# EAGLE design DBGadapter (EAGLE 7.1.0)
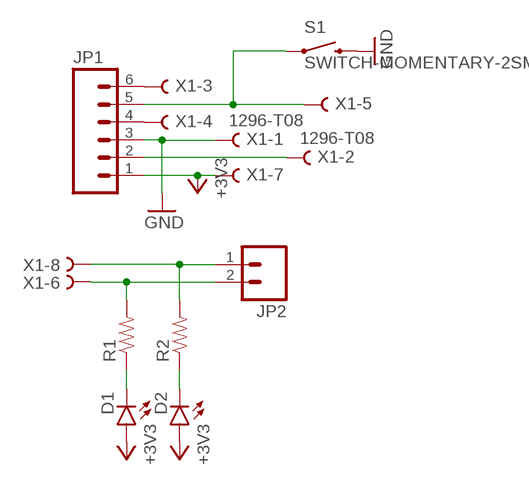
[diagram p0: schematic, sheet 1]

## Parts
D1  LED0603  [LED-0603]
D2  LED0603  [LED-0603]
JP1  M06LOCK_LONGPADS  [1X06_LOCK_LONGPADS]
JP2  M02LOCK_LONGPADS  [1X02_LOCK_LONGPADS]
R1  RESISTOR0805-RES  [0805]
R2  RESISTOR0805-RES  [0805]
S1  SWITCH-MOMENTARY-2SMD  [TACTILE-SWITCH-SMD]
X1  1296-T08  [1296-08]

## Nets
+3V3: D1.A D2.A JP1.1 X1.7
GND: JP1.3 S1.3 X1.1
N$1: JP1.2 X1.2
N$2: JP1.4 X1.4
N$3: JP1.5 S1.1 X1.5
N$5: JP1.6 X1.3
N$6: JP2.1 R2.2 X1.8
N$7: JP2.2 R1.2 X1.6
N$8: D2.C R2.1
N$9: D1.C R1.1

## Library data of the parts
D1 D2 = SparkFun-LED:LED: LEDs Standard schematic elements and footprints for 5mm, 3mm, 1206, and 0603 sized LEDs. 5mm - Spark Fun Electronics SKU : COM-00529 (and others)
JP1 = SparkFun-Connectors:M06: Header 6 Standard 6-pin 0.1" header. Use with straight break away headers (SKU : PRT-00116), right angle break away headers (PRT-00553), swiss pins (PRT-00743), machine pins (PRT-00117), and female headers (PRT-00115). Molex polarized connector foot print use with SKU : PRT-08094 with associated crimp pins and housings. NOTES ON THE VARIANTS LOCK and LOCK_LONGPADS... This footprint was designed to help hold the alignment of a through-hole component (i.e. 6-pin header) while soldering it into place. You may notice that each hole has been shifted either up or down by 0.005 of an inch from it's more standard position (which is a perfectly straight line). This slight alteration caused the pins (the squares in the middle) to touch the edges of the holes. Because they are alternating, it causes a "brace" to hold the component in place. 0.005 has proven to be the perfect amount of "off-center" position when using our standard breakaway headers. Although looks a little odd when you look at the bare footprint, once you have a header in there, the alteration is very hard to notice. Also,if you push a header all the way into place, it is covered up entirely on the bottom side. This idea of altering the position of holes to aid alignment will be further integrated into the Sparkfun Library for other footprints. It can help hold any component with 3 or more connection pins.
JP2 = SparkFun-Connectors:M02: Standard 2-pin 0.1" header. Use with - straight break away headers ( PRT-00116) - right angle break away headers (PRT-00553) - swiss pins (PRT-00743) - machine pins (PRT-00117) - female headers (PRT-00115) Molex polarized connector foot print use with: PRT-08233 with associated crimp pins and housings. 2.54_SCREWTERM for use with PRT-10571. 3.5mm Screw Terminal footprints for PRT-08084 5mm Screw Terminal footprints for use with PRT-08432
R1 R2 = SparkFun-Resistors:RESISTOR: Resistor Basic schematic elements and footprints for 0603, 1206, and PTH resistors.
S1 = SparkFun-Electromechanical:SWITCH-MOMENTARY-2: Various NO switches- pushbuttons, reed, etc; PROD_ID: SWCH-08247
X1 = con-leotronics:1296-T08: 1.27mm SINGLE ROW FEMALE SOCKET Source: http://www.leotronics.co.uk/Conexcon/Data%20Sheets/sec.%20A/1296ing.pdf; OC_FARNELL: unknown; OC_NEWARK: unknown

## Board
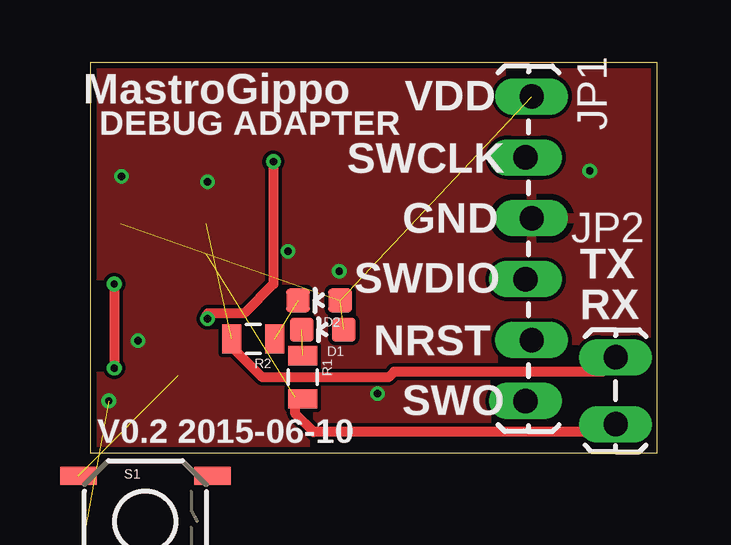
[diagram p1: board, top side]
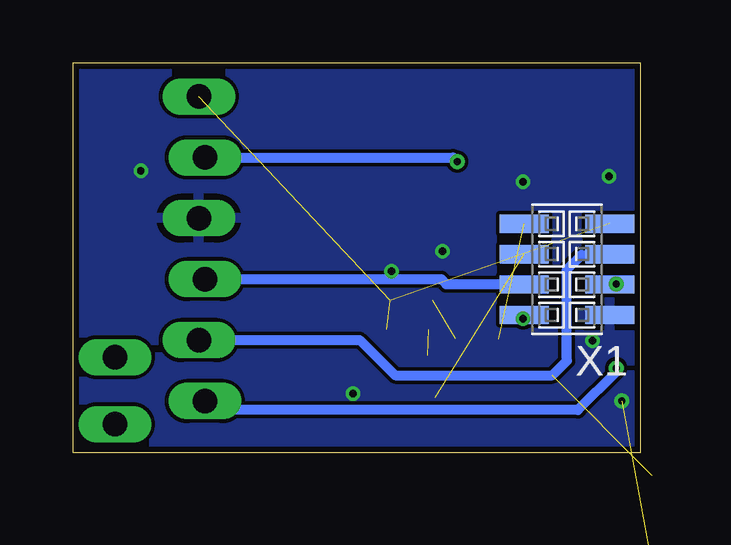
[diagram p2: board, bottom side, seen from below]

Size 23.64 x 16.26 mm. Coordinates in mm from the lower left corner, seen from the top.
Outline: 23.64,0 23.64,16.26 0,16.26 0,0 23.64,0
Copper layers (1*16): Top 0.035mm / dielectric 1.5mm / Bottom 0.035mm
Design rules "ITEADstudio_DRC": minimum track width 6mil, minimum drill 12mil, track to track 6mil, track to pad 6mil, pad to pad 6mil, via to via 6mil, smd to smd 0mil, copper to edge 10mil, drill to drill 10mil, minimum pad ring 10mil, minimum via ring 6mil, stop-mask expansion 2mil, vias tented up to drill 100mil, thermal gap 10mil

### Footprints (pad centres in the part's own frame; a part is rotated, then mirrored left to right if it is on the bottom)
LED-0603 = smd 1 x 1: A 0,-0.877; C 0,0.877
1X06_LOCK_LONGPADS = drill 1.016 long: 1 0,0; 2 2.54,-0.254; 3 5.08,0; 4 7.62,-0.254; 5 10.16,0; 6 12.7,-0.254
1X02_LOCK_LONGPADS = drill 1.016 long: 1 -0.127,0; 2 2.667,0
0805 = smd 0.8 x 1.2: 1 -0.9,0; 2 0.9,0
TACTILE-SWITCH-SMD = smd 1.524 x 0.762: 1 -2.794,1.905; 2 2.794,1.905; 3 -2.794,-1.905; 4 2.794,-1.905
1296-08 = smd 0.76 x 2.05: 1 -1.905,-1.78; 2 -1.905,1.78; 3 -0.635,-1.78; 4 -0.635,1.78; 5 0.635,-1.78; 6 0.635,1.78; 7 1.905,-1.78; 8 1.905,1.78

### Placement (x,y rotation side)
D1  9.69,5.13 90 top
D2  9.54,6.35 90 top
JP1  18.4,14.86 270 top
JP2  21.9,3.86 270 top
R1  8.86,3.15 270 top
R2  6.8,4.75 180 top
S1  2.3,-2.87 0 top
X1  3.06,7.65 90 bottom

### Tracks (layer width: path | path; a pad name or v marks a point on that pad's centre or on a via)
+3V3  (3 unrouted)
GND  (via drill 0.3)  (1 unrouted)
  other vias: 2,4.67 0.78,2.16 10.38,7.57 8.25,8.41 4.89,11.3 1.31,11.53 20.82,11.76 11.98,2.46
  pour Bottom: 0,0 23.64,0 23.64,19 0,19
  pour Top: 0,0 0,19 23.64,19 23.64,0
N$1  (via drill 0.3)
  Top 0.406: v7.64,12.14 7.64,7.04 6.42,5.82 4.92,5.82 X1.2 4.92,5.56 v4.89,5.59
  Bottom 0.406: JP1.2 7.81,12.32 v7.64,12.14 | v4.89,5.59 4.89,5.69 X1.2
N$2
  Bottom 0.406: JP1.4 8.29,7.24 8.09,7.04 4.87,7.04 X1.4
N$3  (1 unrouted)
  Bottom 0.406: JP1.5 11.7,4.7 10.23,3.23 3.67,3.23 3.06,3.84 3.06,7.65 2.45,8.26 1.31,8.26 X1.5
N$5  (via drill 0.3)
  Top 0.406: v1.01,7.04 v1.01,3.53
  Bottom 0.406: X1.3 1.03,7.01 v1.01,7.04 | v1.01,3.53 1.01,3.38 2.61,1.78 17.77,1.78 JP1.6
N$6  (1 unrouted)
  Top 0.406: JP2.1 21.9,3.93 21.35,3.38 12.66,3.38 12.44,3.15 7.18,3.15 5.81,4.52 R2.2
N$7  (1 unrouted)
  Top 0.406: JP2.2 21.6,1.19 20.59,0.86 9.31,0.86 8.55,1.63 8.55,2.3 R1.2
N$8  (1 unrouted)
N$9  (1 unrouted)

### Text on the board
tNames: MastroGippo | VDD | DEBUG ADAPTER | SWCLK | GND | SWDIO | TX | RX | NRST | SWO | V0.2 2015-06-10